# EAGLE design ft240x (EAGLE 6.6.0)
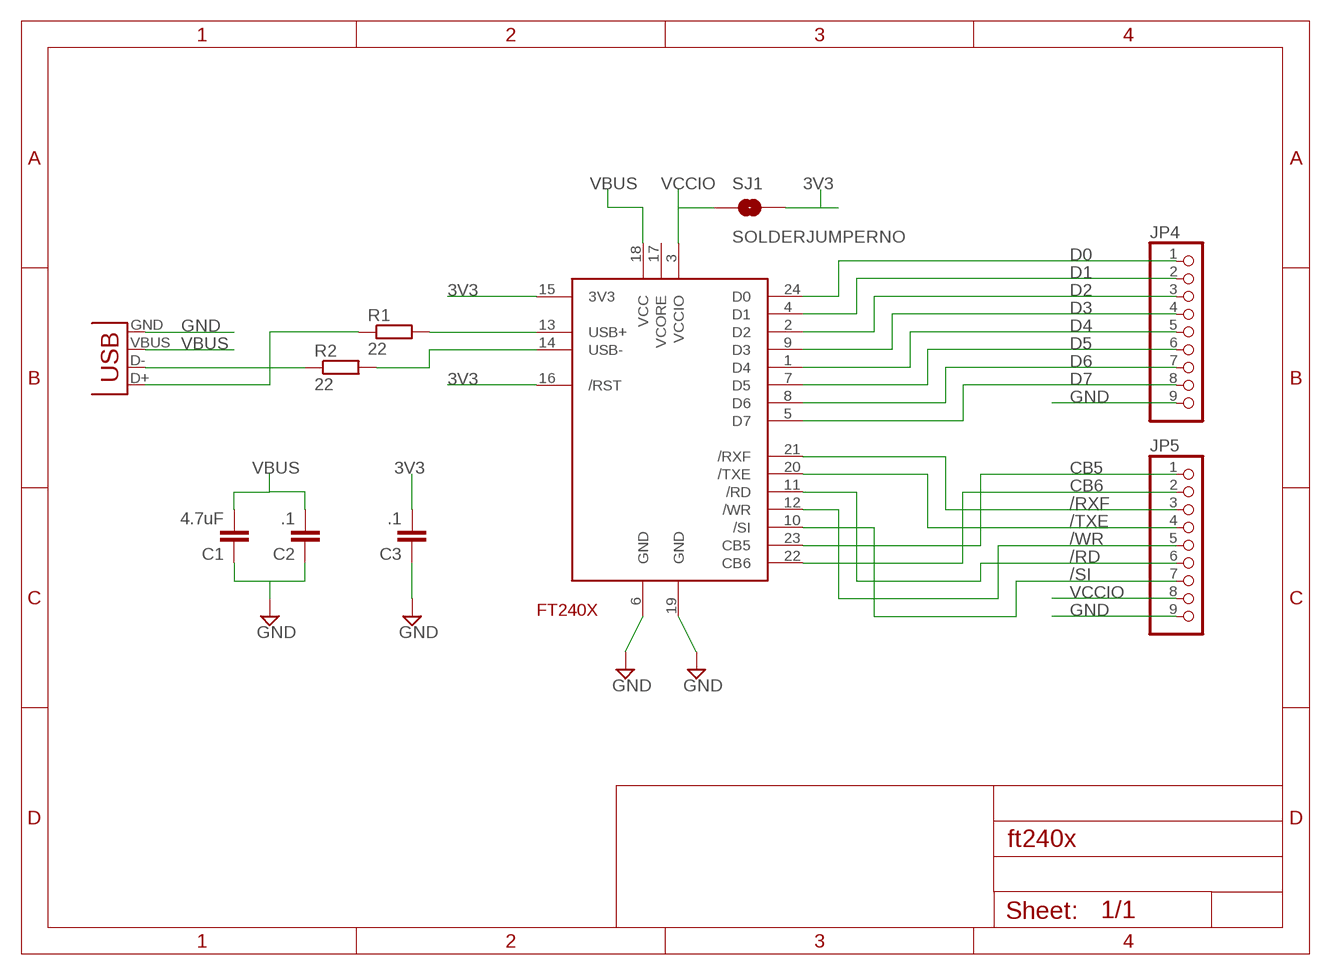
[diagram p0: schematic, sheet 1]

## Parts
C1  4.7uF  C-EUC0603  [C0603]
C2  .1  C-EUC0603  [C0603]
C3  .1  C-EUC0603  [C0603]
JP3  USBSMD  [USB-MINIB]
JP4  HEADER-1X970MIL  [1X09_ROUND_70]
JP5  HEADER-1X970MIL  [1X09_ROUND_70]
R1  22  R-EU_R0603  [R0603]
R2  22  R-EU_R0603  [R0603]
SJ1  SOLDERJUMPERNO  [SJ_2S-NO]
U$1  IHSAN_FT240X  [SSOP24]

## Nets
3V3: C3.2 SJ1.2 U$1.15(3V3) U$1.16(/RST)
/RD: JP5.6 U$1.11(/RD)
/RXF: JP5.3 U$1.21(/RXF)
/SI: JP5.7 U$1.10(/SI)
/TXE: JP5.4 U$1.20(/TXE)
/WR: JP5.5 U$1.12(/WR)
CB5: JP5.1 U$1.23(CB5)
CB6: JP5.2 U$1.22(CB6)
D0: JP4.1 U$1.24(D0)
D1: JP4.2 U$1.4(D1)
D2: JP4.3 U$1.2(D2)
D3: JP4.4 U$1.9(D3)
D4: JP4.5 U$1.1(D4)
D5: JP4.6 U$1.7(D5)
D6: JP4.7 U$1.8(D6)
D7: JP4.8 U$1.5(D7)
GND: C1.1 C2.1 C3.1 JP3.GND JP4.9 JP5.9 U$1.6(GND) U$1.19(GND)
N$16: R1.2 U$1.13(USB+)
N$17: R2.2 U$1.14(USB-)
N$18: JP3.D+ R1.1
N$19: JP3.D- R2.1
VBUS: C1.2 C2.2 JP3.VBUS U$1.18(VCC)
VCCIO: JP5.8 SJ1.1 U$1.3(VCCIO)
Unconnected: U$1.17(VCORE)

## Library data of the parts
C1-C3 = rcl:C-EU: CAPACITOR, European symbol
JP3 = SparkFun-Connectors:USB: USB Connectors USB-B-PTH is fully proven SKU : PRT-00139/CONN-08278 USB-miniB is fully proven SKU : PRT-00587 USB-A-PCB is untested. USB-A-H is throughly reviewed, but untested. Spark Fun Electronics SKU : PRT-00437 USB-B-SMT is throughly reviewed, but untested. Needs silkscreen touching up. USB-A-S has not been used/tested USB-MB-H has not been used/tested USB-MICROB has been used. CONN-09505
JP4 JP5 = microbuilder:HEADER-1X9: PIN HEADER
R1 R2 = rcl:R-EU_: RESISTOR, European symbol
SJ1 = SparkFun-Passives:SOLDERJUMPER: Solder Jumper Standard SMD solder jumper. Used to automate production. Two varients : Normally Open and Normally Closed are the same, but have different paste layers. NC will have a large amount of paste and should jumper during reflow.
U$1 = SparkFun-DigitalIC_ihsan:IHSAN_FT240X

## Board
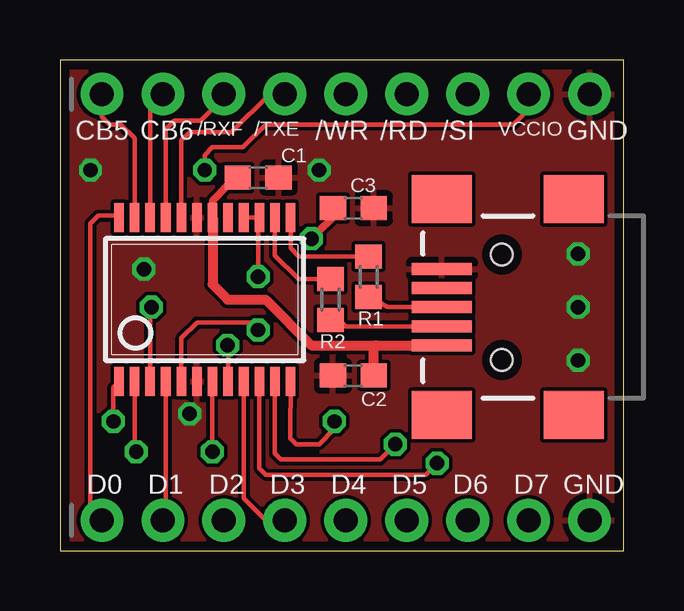
[diagram p1: board, top side]
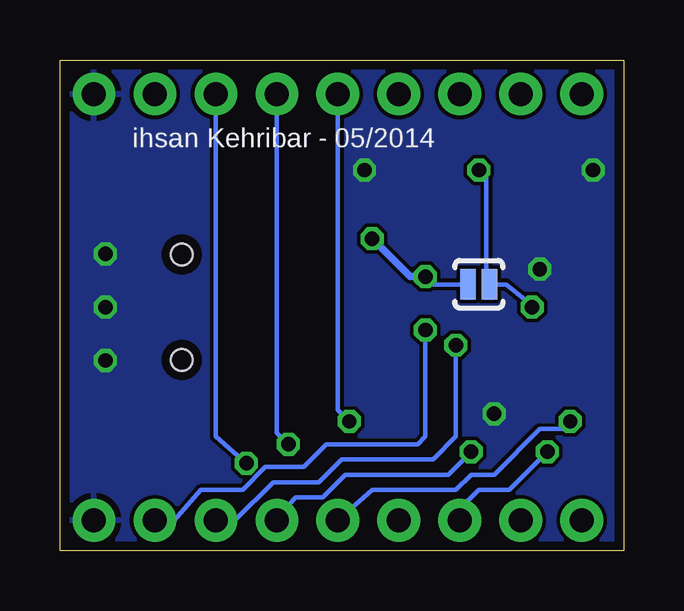
[diagram p2: board, bottom side, seen from below]

Size 23.48 x 20.47 mm. Coordinates in mm from the lower left corner, seen from the top.
Outline: 0,0 23.48,0 23.48,20.47 0,20.47 0,0
Copper layers (1*16): Top 0.0356mm / dielectric 1.5011mm / Bottom 0.0356mm
Design rules "LaenPCBOrder": minimum track width 6mil, minimum drill 13mil, track to track 6mil, track to pad 6mil, pad to pad 6mil, via to via 6mil, smd to smd 6mil, copper to edge 15mil, drill to drill 6mil, minimum pad ring 7mil, minimum via ring 7mil, stop-mask expansion 4mil, vias tented up to drill 0mil, thermal gap 10mil

### Footprints (pad centres in the part's own frame; a part is rotated, then mirrored left to right if it is on the bottom)
C0603 = smd 1.1 x 1: 1 -0.85,0; 2 0.85,0
USB-MINIB = smd 2.5 x 0.5: D+ 2.5,0; D- 2.5,0.8; GND 2.5,-1.6; ID 2.5,-0.8; VBUS 2.5,1.6 | smd 2.5 x 2: MTN1 -3,4.5; MTN2 2.5,4.5; MTN3 -3,-4.5; MTN4 2.5,-4.5 | hole 0.9: 0,2.2; 0,-2.2
1X09_ROUND_70 = drill 1 pad 1.778: 1 -10.16,0; 2 -7.62,0; 3 -5.08,0; 4 -2.54,0; 5 0,0; 6 2.54,0; 7 5.08,0; 8 7.62,0; 9 10.16,0
R0603 = smd 1 x 1.1: 1 -0.85,0; 2 0.85,0
SJ_2S-NO = smd 0.635 x 1.27: 1 -0.45,0; 2 0.45,0
SSOP24 = smd 0.4 x 1.2: 1 -3.575,-2.15; 2 -2.925,-2.15; 3 -2.275,-2.15; 4 -1.625,-2.15; 5 -0.975,-2.15; 6 -0.325,-2.15; 7 0.325,-2.15; 8 0.975,-2.15; 9 1.625,-2.15; 10 2.275,-2.15; 11 2.925,-2.15; 12 3.575,-2.15; 13 3.575,4.69; 14 2.925,4.69; 15 2.275,4.69; 16 1.625,4.69; 17 0.975,4.69; 18 0.325,4.69; 19 -0.325,4.69; 20 -0.975,4.69; 21 -1.625,4.69; 22 -2.275,4.69; 23 -2.925,4.69; 24 -3.575,4.69

### Placement (x,y rotation side)
C1  8.26,15.56 180 top
C2  12.22,7.3 0 top
C3  12.22,14.29 180 top
JP3  18.41,10.16 180 top
JP4  11.91,1.27 0 top
JP5  11.91,19.05 0 top
R1  12.86,11.43 90 top
R2  11.27,10.48 90 top
SJ1  6.03,11.11 180 bottom
U$1  6.03,9.21 0 top

### Tracks (layer width: path | path; a pad name or v marks a point on that pad's centre or on a via)
3V3  (via drill 0.6 pad 0.25)
  Top 0.191: U$1.16 U$1.15 8.26,13.85 v8.26,11.43
  Top 0.305: C3.2 11.59,14.13 v10.48,13.02
  Bottom 0.191: SJ1.2 7.94,11.11 v8.26,11.43
  Bottom 0.305: v10.48,13.02 8.89,11.43 v8.26,11.43
/RD  (via drill 0.6 pad 0.25)
  Top 0.191: U$1.11 8.96,4.06 9.21,3.81 13.34,3.81 v13.97,4.45
  Bottom 0.191: JP5.6 14.45,4.92 v13.97,4.45
/RXF
  Top 0.191: U$1.21 4.41,17.58 4.76,17.94 5.87,17.94 6.51,18.57 6.51,18.73 JP5.3
/SI  (via drill 0.6 pad 0.25)
  Top 0.191: U$1.10 8.31,3.44 8.57,3.17 15.24,3.17 v15.72,3.65
  Bottom 0.191: JP5.7 16.99,4.76 v15.72,3.65
/TXE
  Top 0.191: U$1.20 5.06,17.12 5.4,17.46 7.14,17.46 8.73,19.05 JP5.4
/WR  (via drill 0.6 pad 0.25)
  Top 0.191: U$1.12 9.6,4.83 9.6,4.69 9.84,4.45 10.79,4.45 11.43,5.08 v11.43,5.4
  Bottom 0.191: JP5.5 11.91,5.87 v11.43,5.4
CB5
  Top 0.191: U$1.23 3.11,17.21 2.54,17.78 2.06,17.78 1.75,18.1 JP5.1
CB6
  Top 0.191: U$1.22 3.76,18.52 JP5.2
D0
  Top 0.191: U$1.24 2.38,13.97 1.59,13.97 1.27,13.65 1.27,1.75 JP4.1
D1
  Top 0.191: U$1.4 4.41,1.39 JP4.2
D2  (via drill 0.6 pad 0.25)
  Top 0.191: U$1.2 3.11,4.2 v3.17,4.13
  Bottom 0.191: v3.17,4.13 4.76,2.54 6.03,2.54 6.83,1.75 JP4.3
D3
  Top 0.191: U$1.9 7.66,2.19 8.57,1.27 JP4.4
D4  (via drill 0.6 pad 0.25)
  Top 0.191: v2.22,5.4 2.22,6.82 U$1.1
  Bottom 0.191: JP4.5 10.48,2.54 6.99,2.54 6.35,3.17 5.4,3.17 3.49,5.08 2.54,5.08 v2.22,5.4
D5  (via drill 0.6 pad 0.25)
  Top 0.191: v6.35,4.13 U$1.7
  Bottom 0.191: v6.35,4.13 7.3,3.17 11.59,3.17 12.54,2.22 13.65,2.22 13.97,1.91 JP4.6
D6  (via drill 0.6 pad 0.25)
  Top 0.191: U$1.8 7.01,8.55 v6.99,8.57
  Bottom 0.191: v6.99,8.57 6.99,4.76 7.94,3.81 11.75,3.81 12.7,2.86 14.61,2.86 16.19,1.27 JP4.7
D7  (via drill 0.6 pad 0.25)
  Top 0.191: U$1.5 5.06,8.87 5.71,9.53 7.94,9.53 v8.26,9.21
  Bottom 0.191: v8.26,9.21 8.26,4.76 8.57,4.45 12.38,4.45 13.34,3.49 14.92,3.49 15.88,2.54 17.62,2.54 18.73,1.27 JP4.8
GND  (via drill 0.6 pad 0.25)
  other vias: 1.27,15.88 3.49,11.75 5.4,5.71 21.59,10.16 21.59,12.38 21.59,7.94 10.79,15.88
  pour Top: 0,20.48 23.5,20.48 23.5,0 0,0
  pour Bottom: 0,20.48 23.5,20.48 23.5,0 0,0
N$16
  Top 0.191: R1.2 9.95,12.28 9.61,12.62 U$1.13
N$17
  Top 0.191: U$1.14 8.96,12.31 9.95,11.33 R2.2
N$18
  Top 0.191: 15.98,10.16 JP3.D+ 13.65,10.16 R1.1
N$19
  Top 0.191: JP3.D- 11.91,9.36 11.75,9.53 R2.1
VBUS
  Top 0.305: U$1.18 6.36,14.61 6.99,15.24 7.09,15.24 C1.2
  Top 0.406: U$1.18 6.36,11.11 6.99,10.48 8.57,10.48 10.48,8.57 13.18,8.57 | 13.18,8.57 15.9,8.57 JP3.VBUS | C2.2 13.07,8.52 13.18,8.57
VCCIO  (via drill 0.6 pad 0.25)
  Top 0.191: U$1.3 3.76,10.11 v3.81,10.16 | v6.03,15.88 6.03,16.51 6.35,16.83 7.62,16.83 8.57,17.78 18.89,17.78 19.53,18.41 JP5.8
  Bottom 0.191: v3.81,10.16 4.13,10.48 4.89,11.11 SJ1.1 5.71,11.24 5.71,15.56 v6.03,15.88

### Text on the board
tPlace: CB5 | CB6 | /RXF | /TXE | /WR | /RD | /SI | VCCIO | GND | D0 | D1 | D2 | D3 | D4 | D5 | D6 | D7 | GND
bPlace: ihsan Kehribar - 05/2014